# EAGLE design STorM32 NT imu v42g4 (EAGLE 7.5.0)
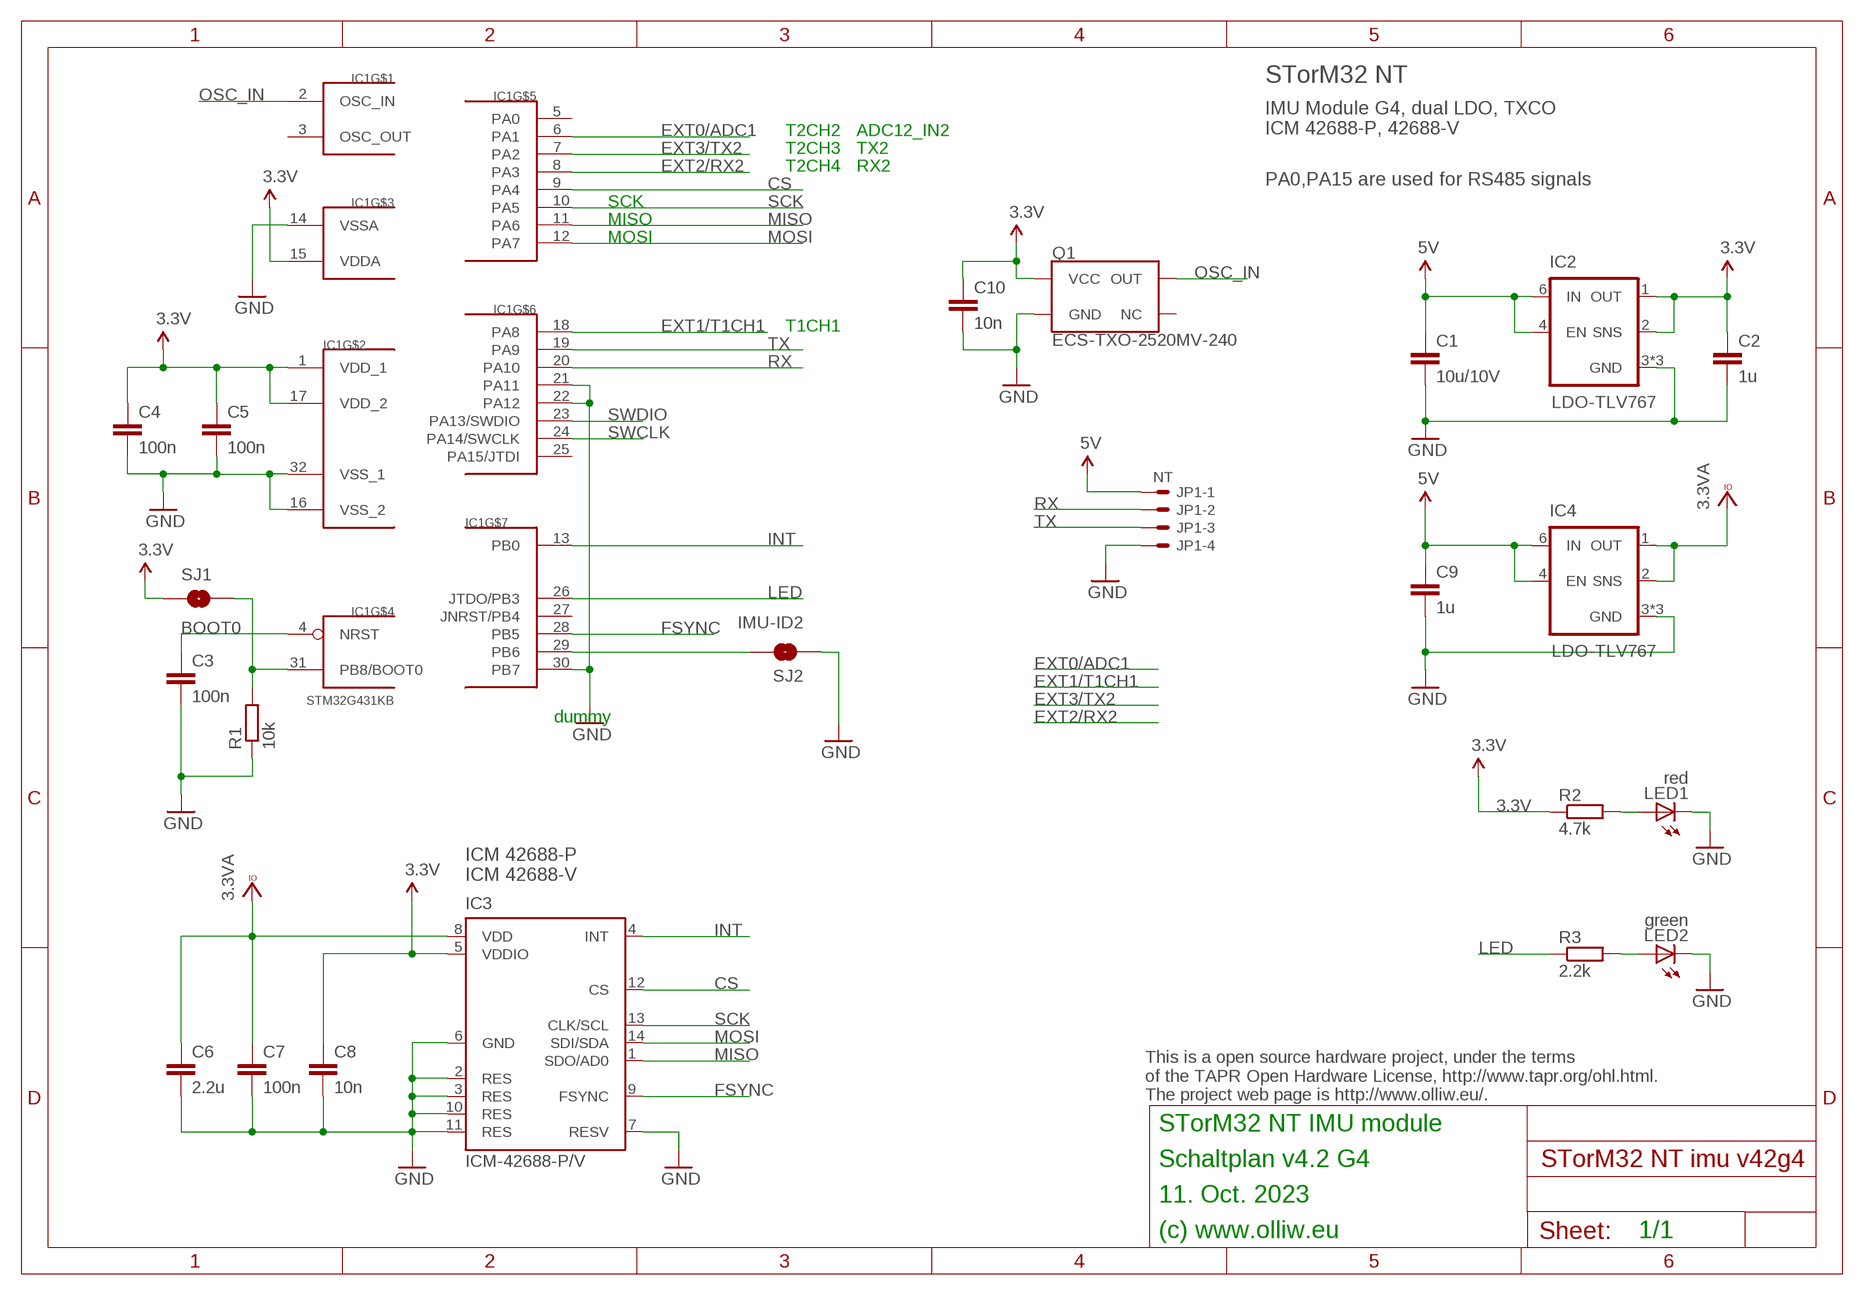
[diagram p0: schematic, sheet 1]

## Parts
C1  10u/10V  C-EUC1206  [C1206]
C2  1u  C-EUC0603  [C0603]
C3  100n  C-EUC0402  [C0402]
C4  100n  C-EUC0402  [C0402]
C5  100n  C-EUC0402  [C0402]
C6  2.2u  C-EUC0603  [C0603]
C7  100n  C-EUC0402  [C0402]
C8  10n  C-EUC0402  [C0402]
C9  1u  C-EUC0402  [C0402]
C10  10n  C-EUC0402  [C0402]
IC1  STM32G431KB  STM32G4X1KX  [UFQFPN32]
IC2  LDO-TLV767  [WSON-6-2X2]
IC3  ICM-42688-P/V  ICM42605  [LGA14-2.5X3]
IC4  LDO-TLV767  [WSON-6-2X2]
JP1  NT  SM04B-SRSS-TB  [SM04B-SRSS-TB]
LED1  red  LEDCHIPLED_0603  [CHIPLED_0603]
LED2  green  LEDCHIPLED_0603  [CHIPLED_0603]
Q1  ECS-TXO-2520MV-240  TXCO-2.5X2.0MM  [TXCO-25X20]
R1  10k  R-EU_R0402  [R0402]
R2  4.7k  R-EU_R0402  [R0402]
R3  2.2k  R-EU_R0402  [R0402]
SJ1  BOOT0  SOLDERJUMPERNO  [SJ_2S-NO]
SJ2  IMU-ID2  SOLDERJUMPERNO  [SJ_2S-NO]

## Nets
3.3V: C2.1 C4.1 C5.1 C8.1 C10.1 IC1.1(VDD_1) IC1.15(VDDA) IC1.17(VDD_2) IC2.1(OUT) IC2.2(SNS) IC3.5(VDDIO) Q1.4(VCC) R2.1 SJ1.1
3.3VA: C6.1 C7.1 IC3.8(VDD) IC4.1(OUT) IC4.2(SNS)
5V: C1.1 C9.1 IC2.4(EN) IC2.6(IN) IC4.4(EN) IC4.6(IN) JP1.1
CS: IC1.9(PA4) IC3.12(CS)
EXT0/ADC1: IC1.6(PA1)
EXT1/T1CH1: IC1.18(PA8)
EXT2/RX2: IC1.8(PA3)
EXT3/TX2: IC1.7(PA2)
FSYNC: IC1.28(PB5) IC3.9(FSYNC)
GND: C1.2 C2.2 C3.2 C4.2 C5.2 C6.2 C7.2 C8.2 C9.2 C10.2 IC1.14(VSSA) IC1.16(VSS_2) IC1.21(PA11) IC1.22(PA12) IC1.30(PB7) IC1.32(VSS_1) IC2.3(GND) IC2.5(GND) IC2.7(GND) IC3.2(RES) IC3.3(RES) IC3.6(GND) IC3.7(RESV) IC3.10(RES) IC3.11(RES) IC4.3(GND) IC4.5(GND) IC4.7(GND) JP1.4 LED1.C LED2.C Q1.2(GND) R1.1 SJ2.1
INT: IC1.13(PB0) IC3.4(INT)
LED: IC1.26(JTDO/PB3) R3.1
MISO: IC1.11(PA6) IC3.1(SDO/AD0)
MOSI: IC1.12(PA7) IC3.14(SDI/SDA)
N$1: C3.1 IC1.4(NRST)
N$2: LED2.A R3.2
N$3: IC1.31(PB8/BOOT0) R1.2 SJ1.2
N$7: IC1.29(PB6) SJ2.2
N$9: LED1.A R2.2
OSC_IN: IC1.2(OSC_IN) Q1.3(OUT)
RX: IC1.20(PA10) JP1.2
SCK: IC1.10(PA5) IC3.13(CLK/SCL)
SWCLK: IC1.24(PA14/SWCLK)
SWDIO: IC1.23(PA13/SWDIO)
TX: IC1.19(PA9) JP1.3
Unconnected: IC1.3(OSC_OUT) IC1.5(PA0) IC1.25(PA15/JTDI) IC1.27(JNRST/PB4) Q1.1(NC)

## Notes on the sheet
- STorM32 NT
- IMU Module G4, dual LDO, TXCO
  ICM 42688-P, 42688-V
- T2CH2 | ADC12_IN2
- T2CH3 | TX2
- T2CH4 | RX2 | PA0,PA15 are used for RS485 signals
- SCK
- MISO
- MOSI
- T1CH1
- dummy
- ICM 42688-P
  ICM 42688-V
- This is a open source hardware project, under the terms
  of the TAPR Open Hardware License, http://www.tapr.org/ohl.html.
  The project web page is http://www.olliw.eu/.
- STorM32 NT IMU module
- Schaltplan v4.2 G4
- 11. Oct. 2023
- (c) www.olliw.eu | 1/1

## Library data of the parts
C1-C10 = rcl:C-EU: CAPACITOR, European symbol
IC1 = # stm32:STM32G4X1KX
IC2 IC4 = # stdlib:LDO-TLV767
IC3 = # stdlib:ICM42605
JP1 = con-jst2:?M04B-SRSS-TB: Disconnectable Crimp style connector, 1.0mm pitch 4 contacts
LED1 LED2 = led:LED: LED OSRAM: - CHIPLED LG R971, LG N971, LY N971, LG Q971, LY Q971, LO R971, LY R971 LH N974, LH R974 LS Q976, LO Q976, LY Q976 LO Q996 - Hyper CHIPLED LW Q18S LB Q993, LB Q99A, LB R99A - SideLED LS A670, LO A670, LY A670, LG A670, LP A670 LB A673, LV A673, LT A673, LW A673 LH A674 LY A675 LS A676, LA A676, LO A676, LY A676, LW A676 LS A679, LY A679, LG A679 - Hyper Micro SIDELED® LS Y876, LA Y876, LO Y876, LY Y876 LT Y87S - SmartLED LW L88C, LW L88S LB L89C, LB L89S, LG L890 LS L89K, LO L89K, LY L89K LS L896, LA L896, LO L896, LY L896 - TOPLED LS T670, LO T670, LY T670, LG T670, LP T670 LSG T670, LSP T670, LSY T670, LOP T670, LYG T670 LG T671, LOG T671, LSG T671 LB T673, LV T673, LT T673, LW T673 LH T674 LS T676, LA T676, LO T676, LY T676, LB T676, LH T676, LSB T676, LW T676 LB T67C, LV T67C, LT T67C, LS T67K, LO T67K, LY T67K, LW E67C LS E67B, LA E67B, LO E67B, LY E67B, LB E67C, LV E67C, LT E67C LW T67C LS T679, LY T679, LG T679 LS T770, LO T770, LY T770, LG T770, LP T770 LB T773, LV T773, LT T773, LW T773 LH T774 LS E675, LA E675, LY E675, LS T675 LS T776, LA T776, LO T776, LY T776, LB T776 LHGB T686 LT T68C, LB T68C - Hyper Mini TOPLED® LB M676 - Mini TOPLED Santana® LG M470 LS M47K, LO M47K, LY M47K Source: http://www.osram.convergy.de LUXEON: - LUMILED® LXK2-PW12-R00, LXK2-PW12-S00, LXK2-PW14-U00, LXK2-PW14-V00 LXK2-PM12-R00, LXK2-PM12-S00, LXK2-PM14-U00 LXK2-PE12-Q00, LXK2-PE12-R00, LXK2-PE12-S00, LXK2-PE14-T00, LXK2-PE14-U00 LXK2-PB12-K00, LXK2-PB12-L00, LXK2-PB12-M00, LXK2-PB14-N00, LXK2-PB14-P00, LXK2-PB14-Q00 LXK2-PR12-L00, LXK2-PR12-M00, LXK2-PR14-Q00, LXK2-PR14-R00 LXK2-PD12-Q00, LXK2-PD12-R00, LXK2-PD12-S00 LXK2-PH12-R00, LXK2-PH12-S00 LXK2-PL12-P00, LXK2-PL12-Q00, LXK2-PL12-R00 Source: www.luxeon.com KINGBRIGHT: KA-3528ASYC Source: www.kingbright.com
Q1 = # stdlib:TXCO
R1-R3 = rcl:R-EU_: RESISTOR, European symbol
SJ1 SJ2 = # SparkFun2:SOLDERJUMPER: Solder Jumper Standard SMD solder jumper. Used to automate production. Two varients : Normally Open and Normally Closed are the same, but have different paste layers. NC will have a large amount of paste and should jumper during reflow.

## Board
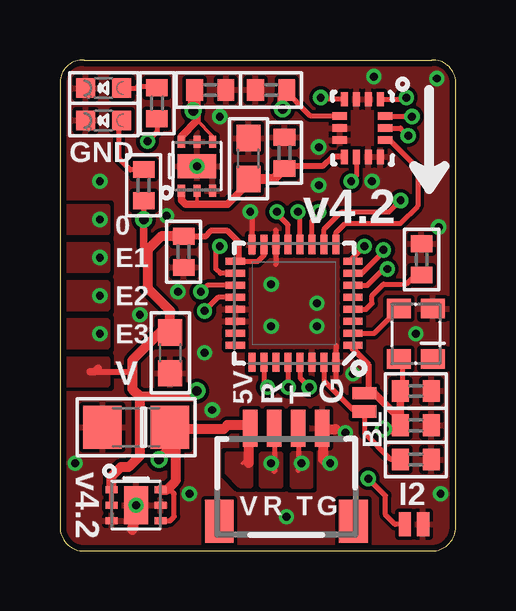
[diagram p1: board, top side]
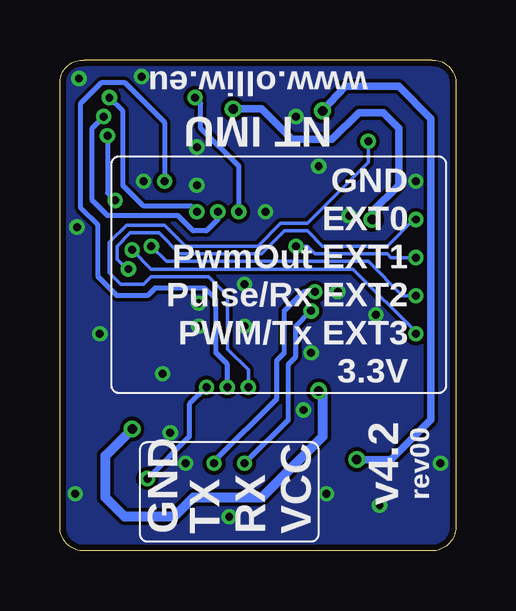
[diagram p2: board, bottom side, seen from below]

Size 16.51 x 20.46 mm. Coordinates in mm from the lower left corner, seen from the top.
Outline: 1,20.46 15.51,20.46 arc-90 16.51,19.54 16.51,1 arc-90 15.51,0 1,0 arc-90 0,1 0,19.54 arc-90 1,20.46
Copper layers (1*16): Top 0.035mm / dielectric 1.5mm / Bottom 0.035mm
Design rules "Fusion_eagle_rule_v1.1-shapes-supply-changed": minimum track width 6mil, minimum drill 12mil, track to track 6mil, track to pad 6mil, pad to pad 6mil, via to via 6mil, smd to smd 0mil, copper to edge 10mil, drill to drill 10mil, minimum pad ring 10mil, minimum via ring 6mil, stop-mask expansion 2mil, vias tented up to drill 100mil, thermal gap 6mil

### Footprints (pad centres in the part's own frame; a part is rotated, then mirrored left to right if it is on the bottom)
C1206 = smd 1.6 x 1.8: 1 -1.4,0; 2 1.4,0
C0603 = smd 1.1 x 1: 1 -0.85,0; 2 0.85,0
C0402 = smd 0.7 x 0.9: 1 -0.65,0; 2 0.65,0
UFQFPN32 = smd 0.8 x 0.3: 1 -2.45,1.75; 2 -2.45,1.25; 3 -2.45,0.75; 4 -2.45,0.25; 5 -2.45,-0.25; 6 -2.45,-0.75; 7 -2.45,-1.25; 8 -2.45,-1.75; 17 2.45,-1.75; 18 2.45,-1.25; 19 2.45,-0.75; 20 2.45,-0.25; 21 2.45,0.25; 22 2.45,0.75; 23 2.45,1.25; 24 2.45,1.75 | smd 0.3 x 0.8: 9 -1.75,-2.45; 10 -1.25,-2.45; 11 -0.75,-2.45; 12 -0.25,-2.45; 13 0.25,-2.45; 14 0.75,-2.45; 15 1.25,-2.45; 16 1.75,-2.45; 25 1.75,2.45; 26 1.25,2.45; 27 0.75,2.45; 28 0.25,2.45; 29 -0.25,2.45; 30 -0.75,2.45; 31 -1.25,2.45; 32 -1.75,2.45
WSON-6-2X2 = smd 0.5 x 0.3: 1 -1.025,0.65; 2 -1.025,0; 3 -1.025,-0.65; 4 1.025,-0.65; 5 1.025,0; 6 1.025,0.65 | smd 1 x 1.6: 7 0,0
LGA14-2.5X3 = smd 0.6 x 0.3: 1 -1.2,0.75; 2 -1.2,0.25; 3 -1.2,-0.25; 4 -1.2,-0.75; 8 1.2,-0.75; 9 1.2,-0.25; 10 1.2,0.25; 11 1.2,0.75 | smd 0.3 x 0.6: 5 -0.5,-0.95; 6 0,-0.95; 7 0.5,-0.95; 12 0.5,0.95; 13 0,0.95; 14 -0.5,0.95
SM04B-SRSS-TB = smd 0.6 x 1.55: 1 -1.5,2.975; 2 -0.5,2.975; 3 0.5,2.975; 4 1.5,2.975 | smd 1.2 x 1.8: FIT@1 -2.8,-0.9; FIT@2 2.8,-0.9
CHIPLED_0603 = smd 0.8 x 0.8: A 0,-0.75; C 0,0.75
TXCO-25X20 = smd 1 x 0.8: 1 -0.7,1.05; 2 -0.7,-1.05; 3 0.7,-1.05; 4 0.7,1.05
R0402 = smd 0.7 x 0.9: 1 -0.65,0; 2 0.65,0
SJ_2S-NO = smd 0.508 x 1.016: 1 -0.381,0; 2 0.381,0

### Placement (x,y rotation side)
C1  3.17,5.16 180 top
C2  4.6,8.26 270 top
C3  15.08,12.14 90 top
C4  5.16,12.46 270 top
C5  14.84,5.24 0 top
C6  7.86,16.35 90 top
C7  9.37,16.59 90 top
C8  8.81,19.21 180 top
C9  6.27,19.21 0 top
C10  14.84,6.67 0 top
IC1  9.76,10.32 180 top
IC2  3.17,1.91 0 top
IC3  12.62,17.62 270 top
IC4  5.71,16.03 90 top
JP1  9.45,2.14 0 top
LED1  1.83,17.94 90 top
LED2  1.83,19.29 90 top
Q1  14.84,9.05 180 top
R1  14.84,3.81 180 top
R2  3.49,15.24 90 top
R3  4.05,18.65 90 top
SJ1  12.7,6.19 270 top
SJ2  14.76,1.11 180 top

### Tracks (layer width: path | path; a pad name or v marks a point on that pad's centre or on a via)
3.3V  (via drill 0.4)
  Top 0.203: IC1.15 8.51,12.32 8.26,12.07 IC1.17 | IC2.2 IC2.1 | IC3.5 10.45,18.12 9.37,19.21 9.37,19.38 C8.1 | R2.1 v3.49,13.81 | Q1.4 14.23,7.84 14.29,7.78 14.29,6.52 C10.1
  Top 0.254: IC1.17 7.46,12.07 7.46,12.06 7.46,12.86 6.99,13.34 6.29,13.34 6.06,13.11 C4.1 | IC1.1 12.21,8.42 12.86,7.78 12.86,6.67 12.76,6.57 SJ1.1 | 14.13,5.22 C5.1 | 1.59,7.62 1.59,7.46 3.02,7.46
  Top 0.305: SJ1.1 13.11,6.57 14.13,5.56 14.13,5.22 | 1.27,7.46 1.43,7.46 1.59,7.62 | C2.1 4.21,9.13 4.45,8.89 4.29,9.21 | 3.65,12.54 3.49,12.7 v3.49,13.81 | C10.1 C5.1
  Top 0.406: 3.33,6.43 3.33,3.97 2.86,3.49 2.54,3.49 2.15,3.1 IC2.1 | 4.29,9.21 4.21,9.13 3.02,7.94 3.02,7.46 3.02,6.75 3.33,6.43 | v5.72,6.67 5.48,6.43 3.33,6.43 | C2.1 4.6,10 3.65,10.95 3.65,12.54 4.22,13.11 C4.1 | v9.29,18.41 9.29,19.05 C8.1 | v13.49,5.08 14.13,5.08 C5.1
  Bottom 0.305: v3.49,13.81 3.49,14.13 2.38,15.24 2.38,17.62 3.02,18.26 4.05,18.26 5.16,17.14 6.83,17.14 8.1,18.41 v9.29,18.41
  Bottom 0.406: v13.49,5.08 14.61,3.97 14.61,2.22 13.81,1.43 11.75,1.43 10.95,2.22 8.1,2.22 5.56,4.76 5.56,6.51 v5.72,6.67
  pour Top: 0.16,8.02 1.98,8.02 1.98,6.91 0.16,6.91
3.3VA
  Top 0.152: IC4.2 5.72,14.45
  Top 0.203: 9.22,16.03 C7.1
  Top 0.254: IC3.8 11.36,16.42 10.95,16.03 9.22,16.03
  Top 0.305: IC4.1 5.07,14.62 5.24,14.45 5.72,14.45 6.99,14.45 7.78,15.24 7.8,15.4 C6.1
  Top 0.406: C6.1 8.93,15.5 C7.1
5V  (via drill 0.4)
  Top 0.152: 7.62,3.65 7.94,3.97 7.87,3.66 | IC4.4 6.37,17.29 5.72,17.94
  Top 0.203: IC2.4 4.59,1.25 4.76,1.43 4.76,2.38 4.59,2.55 4.46,2.55
  Top 0.305: JP1.1 7.9,5.12 7.86,5.08 | IC4.6 5.07,17.29 5.72,17.94 5.72,19.21 5.56,19.37 C9.1 5.56,19.22
  Top 0.406: 7.86,5.08 7.87,3.66 | 4.52,5 C1.1 4.45,4.92 4.81,5.03 4.81,2.91 4.46,2.55 IC2.6 | 4.52,5 4.6,5.08 6.83,5.08 6.99,5.24 7.94,5.24 7.95,5.23 JP1.1 7.95,5.04 | 4.52,5 4.52,4.21 v4.13,3.81 | v5.56,18.34 5.56,19.22
  Bottom 0.305: v4.13,3.81 2.7,3.81 1.03,5.48 1.03,18.02 2.38,19.37 4.6,19.37 v5.56,18.34
  pour Top: 6.98,4.05 7.94,4.05 7.94,2.7 7.54,2.7 6.98,3.25
CS
  Top 0.203: IC3.12 13.76,17.12 14.92,15.95 14.92,14.37 14.21,13.65 11.91,13.65 11.51,13.26 IC1.9
EXT0/ADC1  (via drill 0.33)
  Top 0.203: IC1.6 12.82,11.07 13.49,11.75 v13.65,11.75
  Bottom 0.152: v1.67,13.81 1.75,13.81 2.86,12.7 5.56,12.7 6.19,13.34 7.14,13.34 8.1,12.38 11.51,12.38 12.38,13.26 13.57,13.26 14.13,12.7 14.13,12.14 13.73,11.75 v13.65,11.75
  pour Top: 0.16,14.37 1.98,14.37 1.98,13.26 0.16,13.26
EXT1/T1CH1  (via drill 0.33)
  Top 0.203: IC1.18 6.69,11.57 6.51,11.75 6.51,12.54 v6.67,12.7
  Bottom 0.152: v6.67,12.7 6.19,12.7 5.87,12.38 2.86,12.38 2.7,12.22 v1.67,12.22
  pour Top: 0.16,12.78 1.98,12.78 1.98,11.67 0.16,11.67
EXT2/RX2  (via drill 0.33)
  Top 0.203: IC1.8 12.05,12.05 v12.7,12.7
  Bottom 0.152: v12.7,12.7 12.07,12.06 3.65,12.06 2.22,10.64 v1.67,10.64
  pour Top: 0.16,11.19 1.98,11.19 1.98,10.08 0.16,10.08
EXT3/TX2  (via drill 0.33)
  Top 0.203: v13.49,12.54 13.49,12.46 12.6,11.57 IC1.7
  Bottom 0.152: v13.49,12.54 12.7,11.75 4.29,11.75 1.59,9.05 v1.67,9.05
  pour Top: 0.16,9.6 1.98,9.6 1.98,8.49 0.16,8.49
FSYNC  (via drill 0.33)
  Top 0.203: IC1.28 9.51,6.84 v9.53,6.83 | IC3.9 12.37,15.65 v12.14,15.4
  Bottom 0.203: v9.53,6.83 9.53,7.78 10,8.26 10,10.48 10.48,10.95 12.54,10.95 12.86,10.64 14.13,10.64 14.92,11.43 14.92,13.57 15.64,14.29 15.64,18.65 14.76,19.53 13.81,19.53 12.14,17.86 v12.14,15.4
GND  (via drill 0.33)
  Top 0.203: 11.52,8.56 11.52,7.13 | 9,13.37 9,11.95 | 8.01,13.96 8.01,12.53
  Top 0.406: 10.95,5.16 10.97,5.08 | 10.97,5.08 10.97,3.81 | 10.97,5.08 11.51,5.08 | 3.02,0.87 3.18,1.59
  other vias: 9.45,1.43 8.81,11.11 1.67,15.4 14.84,9.05 10.79,15.24 6.67,18.1 8.81,9.37 10.72,9.37 10.72,10.32 15.72,19.68 15.8,13.49 6.03,8.26 5.71,16.03 6.35,5.87 0.63,3.65 3.17,1.91 15.88,2.38 12.22,7.38 10.79,16.83 13.02,15.4 7.94,14.13 5.4,2.38 11.91,4.92 11.27,3.65 3.33,9.84 4.92,10.79 4.45,13.97 13.1,19.76
  pour Bottom (isolate 0.152): 0.17,19.7 arc-90 0.84,20.37 15.75,20.37 arc-90 16.42,19.7 16.42,0.84 arc-90 15.75,0.17 0.84,0.17 arc-90 0.17,0.84
  pour Top (isolate 0.152, rank 6): 0.17,19.7 arc-90 0.84,20.37 15.75,20.37 arc-90 16.42,19.7 16.42,0.84 arc-90 15.75,0.17 0.84,0.17 arc-90 0.17,0.84
INT  (via drill 0.33)
  Top 0.203: IC1.13 9.51,13.59 9.05,14.05 v9.05,14.13 | IC3.4 10.96,18.82 v10.87,18.89
  Bottom 0.203: v9.05,14.13 9.05,16.03 10.64,17.62 10.64,18.65 v10.87,18.89
LED  (via drill 0.33)
  Top 0.203: IC1.26 8.51,6.96 v8.65,6.83 | R3.1 4.05,17.46 v3.65,17.07
  Bottom 0.152: v3.65,17.07 3.65,16.19 6.19,13.65 7.3,13.65 8.26,12.7 11.27,12.7 12.14,13.57 13.73,13.57 14.45,12.86 14.45,11.59 13.97,11.11 13.02,11.11 12.7,11.43 10.32,11.43 9.53,10.64 9.53,8.41 8.65,7.54 v8.65,6.83
MISO  (via drill 0.33)
  Top 0.203: IC3.1 14.38,18.82 v14.45,18.89 | IC1.11 10.51,13.77 10.8,14.05 v10.8,14.13
  Bottom 0.203: v14.45,18.89 13.89,18.34 13.89,15.24 13.02,14.37 11.03,14.37 v10.8,14.13
MOSI  (via drill 0.33)
  Top 0.203: IC3.14 14.66,18.12 v14.68,18.1 | IC1.12 10.01,14.04 v9.92,14.13
  Bottom 0.203: v9.92,14.13 9.92,13.81 10.4,13.34 10.95,13.34 11.59,13.97 14.53,13.97 15.16,14.61 15.16,17.62 v14.68,18.1
N$1
  Top 0.203: IC1.4 12.77,10.07 13.02,10.32 13.02,10.64 13.49,11.11 14.45,11.11 14.83,11.49 C3.1
N$2
  Top 0.203: LED2.A 3.18,19.29 3.25,19.37 3.64,19.37 R3.2
N$3
  Top 0.203: IC1.31 11.01,7.08 12.22,5.87 12.38,5.87 SJ1.2 12.76,5.81 12.7,5.71 12.7,4.92 13.81,3.81 R1.2
N$7  (via drill 0.33)
  Top 0.203: IC1.29 10.01,7.21 v10.4,6.83 | SJ2.2 13.97,1.11 13.57,1.51 13.57,2.3 v12.86,3.02
  Bottom 0.203: v10.4,6.83 11.11,6.11 11.11,4.76 v12.86,3.02
N$9
  Top 0.203: R2.2 3.41,15.88 2.94,15.88 2.46,16.35 2.46,17.89 LED1.A
OSC_IN
  Top 0.203: IC1.2 13.11,9.07 Q1.3
RX  (via drill 0.33)
  Top 0.203: JP1.2 8.95,3.31 v8.81,3.65 | IC1.20 6.6,10.57 v6.03,10
  Bottom 0.203: v8.81,3.65 6.99,5.48 6.99,7.78 6.67,8.1 6.67,9.37 v6.03,10
  pour Top: 8.41,4.05 9.21,4.05 9.21,2.7 8.41,2.7
SCK  (via drill 0.33)
  Top 0.203: IC3.13 14.21,17.62 v14.53,17.3 | v14.21,14.61 13.73,14.13 11.75,14.13 11.01,13.39 IC1.10
  Bottom 0.203: v14.53,17.3 14.53,14.92 v14.21,14.61
TX  (via drill 0.33)
  Top 0.203: JP1.3 9.95,3.36 v10.08,3.65 | IC1.19 6.15,11.07 v5.87,10.79
  Bottom 0.203: v10.08,3.65 10.08,3.73 7.46,6.35 7.46,7.94 7.14,8.26 7.14,10 6.35,10.79 v5.87,10.79
  pour Top: 9.68,4.05 9.68,2.7 10.48,2.7 10.48,4.05

### Text on the board
tNames: GND | 0 | v4.2 | E1 | E2 | E3 | V | 5V | R | T | G | BL | v4.2 | V | R | T | G | I2
bNames: www.olliw.eu | NT IMU | GND | EXT0 | PwmOut EXT1 | Pulse/Rx EXT2 | PWM/Tx EXT3 | 3.3V | rev00 | v4.2 | VCC | RX | TX | GND